# EAGLE design 328+ch340g_testas (EAGLE 6.5.0)
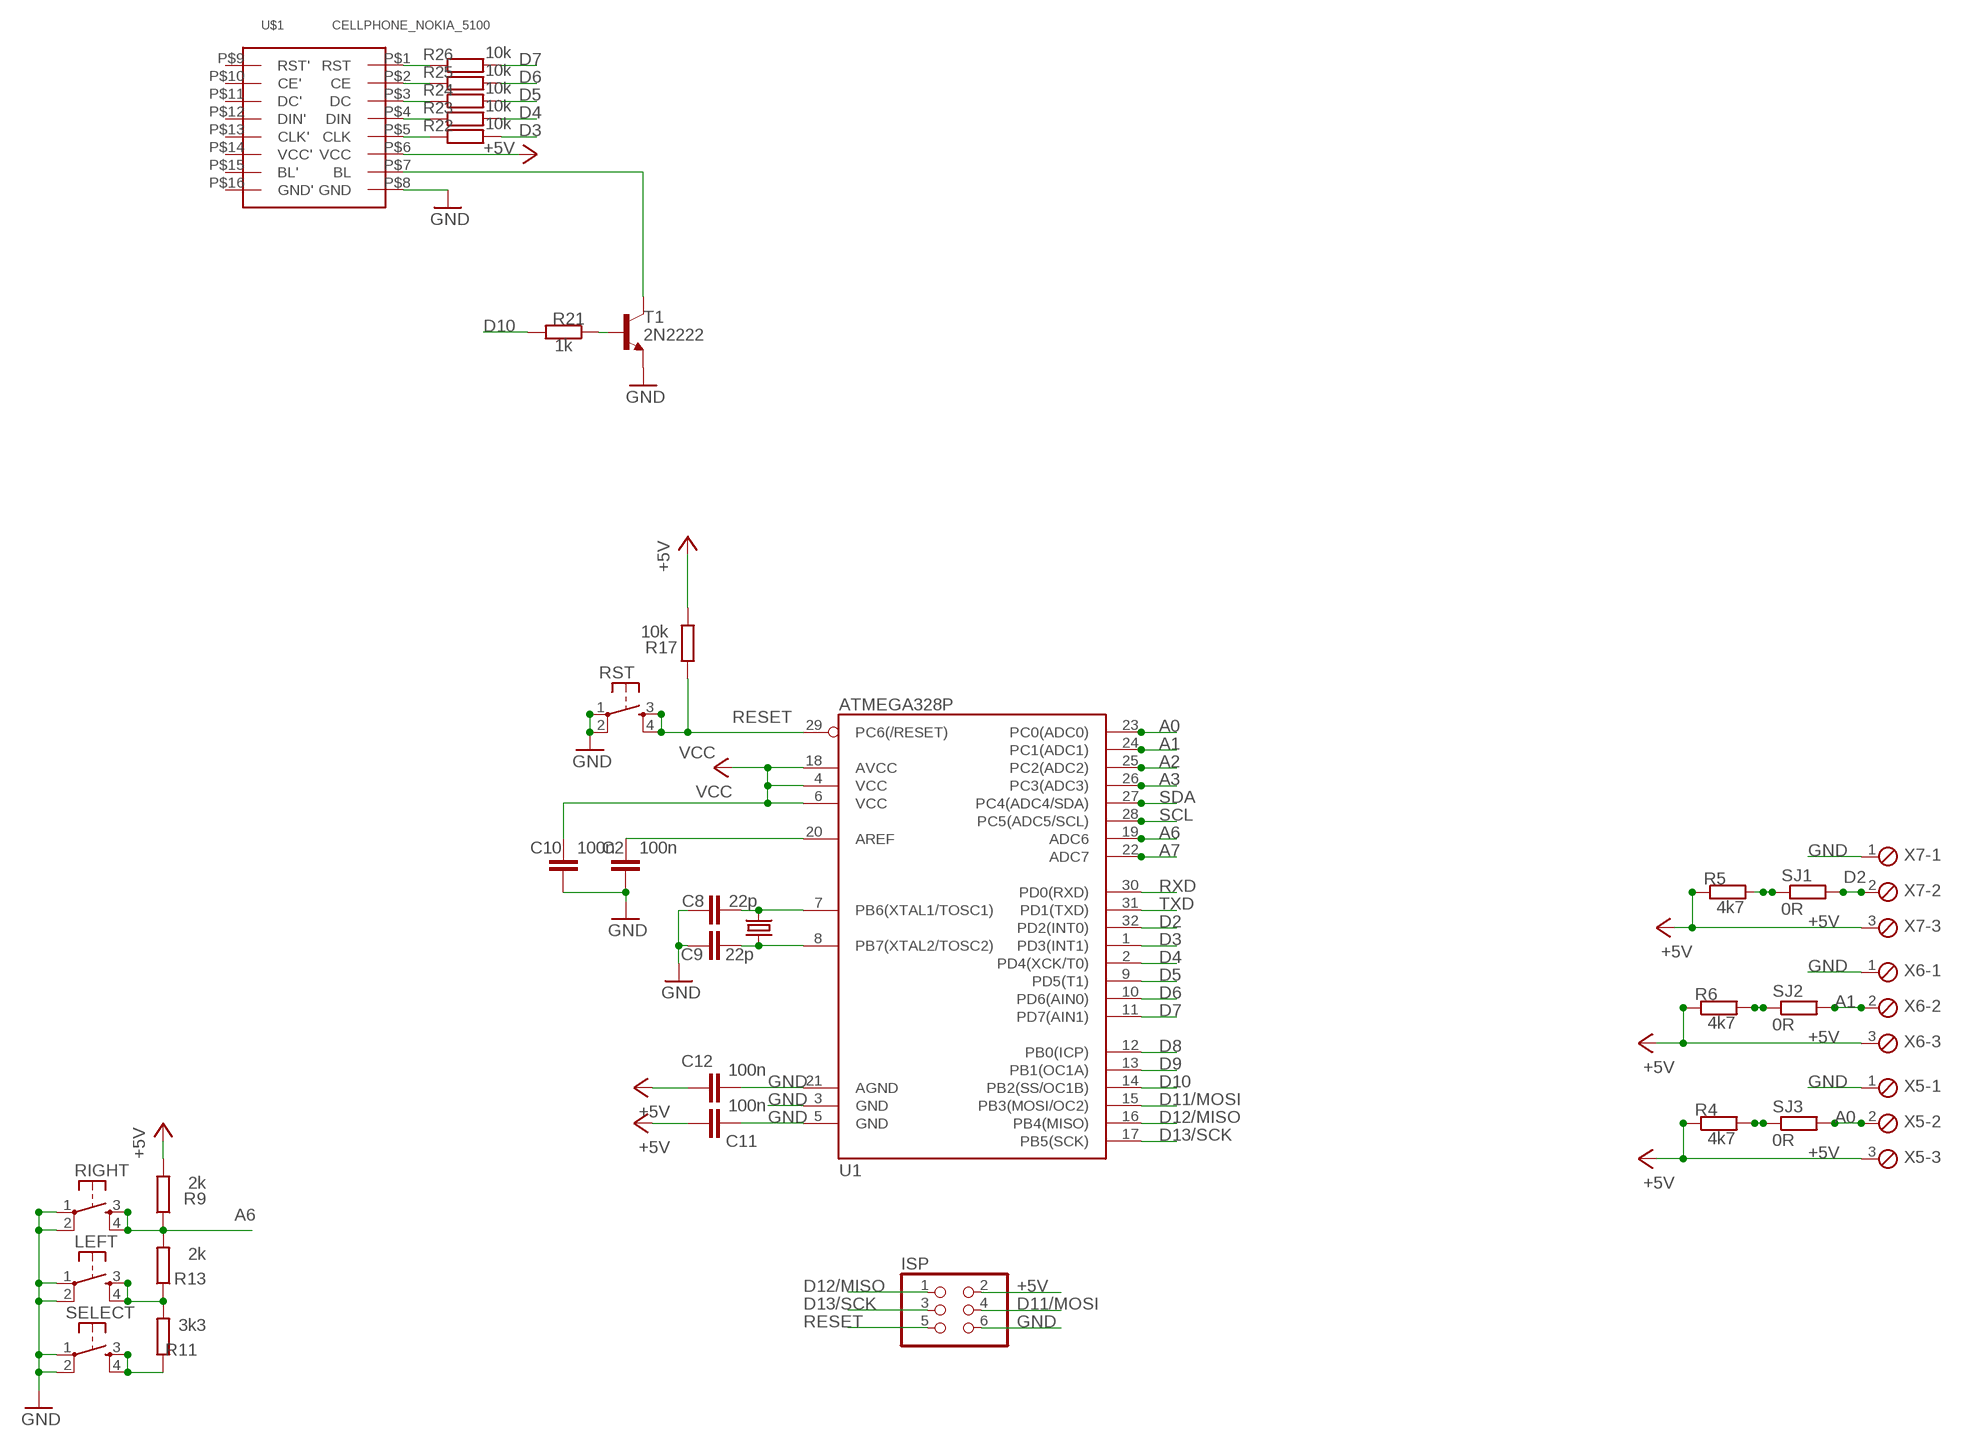
[diagram p0: schematic, sheet 1]

## Parts
C2  100n  C-EUC0805  [C0805]
C8  22p  C-EUC0805  [C0805]
C9  22p  C-EUC0805  [C0805]
C10  100n  C-EUC0805  [C0805]
C11  100n  C-EUC0805  [C0805]
C12  100n  C-EUC0805  [C0805]
ISP  PINHD-2X3  [2X03]
LEFT  TAC_SWITCHPTH  [TACTILE-PTH]
R4  4k7  R-EU_R0805  [R0805]
R5  4k7  R-EU_R0805  [R0805]
R6  4k7  R-EU_R0805  [R0805]
R9  2k  R-EU_R0805  [R0805]
R11  3k3  R-EU_R0805  [R0805]
R13  2k  R-EU_R0805  [R0805]
R17  10k  R-EU_R0805  [R0805]
R21  1k  R-EU_R0805  [R0805]
R22  10k  R-EU_R0805  [R0805]
R23  10k  R-EU_R0805  [R0805]
R24  10k  R-EU_R0805  [R0805]
R25  10k  R-EU_R0805  [R0805]
R26  10k  R-EU_R0805  [R0805]
RIGHT  TAC_SWITCHPTH  [TACTILE-PTH]
RST  TAC_SWITCHPTH  [TACTILE-PTH]
SELECT  TAC_SWITCHPTH  [TACTILE-PTH]
SJ1  0R  R-EU_R0402  [R0402]
SJ2  0R  R-EU_R0402  [R0402]
SJ3  0R  R-EU_R0402  [R0402]
T1  2N2222  [TO92-EBC-OVAL]
U1  ATMEGA328P  ATMEGA328_SMT  [TQFP32-08]
U$1  CELLPHONE_NOKIA_5100  [CELLPHONE_NOKIA_5100_SPARKFUN]
X2  16MHz  CRYSTALHC49US  [HC49US]
X5  MPT3  [3POL254]
X6  MPT3  [3POL254]
X7  MPT3  [3POL254]

## Nets
+5V: C11.2 C12.2 ISP.2 R4.1 R5.1 R6.1 R9.2 R17.2 U$1.P$6(VCC) X5.3 X6.3 X7.3
A0: SJ3.2 U1.23(PC0(ADC0)) X5.2
A1: SJ2.2 U1.24(PC1(ADC1)) X6.2
A2: U1.25(PC2(ADC2))
A3: U1.26(PC3(ADC3))
A6: R9.1 R13.2 RIGHT.3 RIGHT.4 U1.19(ADC6)
A7: U1.22(ADC7)
D2: SJ1.2 U1.32(PD2(INT0)) X7.2
D3: R22.2 U1.1(PD3(INT1))
D4: R23.2 U1.2(PD4(XCK/T0))
D5: R24.2 U1.9(PD5(T1))
D6: R25.2 U1.10(PD6(AIN0))
D7: R26.2 U1.11(PD7(AIN1))
D8: U1.12(PB0(ICP))
D9: U1.13(PB1(OC1A))
D10: R21.2 U1.14(PB2(SS/OC1B))
D11/MOSI: ISP.4 U1.15(PB3(MOSI/OC2))
D12/MISO: ISP.1 U1.16(PB4(MISO))
D13/SCK: ISP.3 U1.17(PB5(SCK))
GND: C2.2 C8.1 C9.1 C10.2 C11.1 C12.1 ISP.6 LEFT.1 LEFT.2 RIGHT.1 RIGHT.2 RST.1 RST.2 SELECT.1 SELECT.2 T1.E U1.3(GND) U1.5(GND) U1.21(AGND) U$1.P$8(GND) X5.1 X6.1 X7.1
N$1: LEFT.3 LEFT.4 R11.2 R13.1
N$17: R6.2 SJ2.1
N$18: R11.1 SELECT.3 SELECT.4
N$22: R22.1 U$1.P$5(CLK)
N$23: R25.1 U$1.P$2(CE)
N$24: R24.1 U$1.P$3(DC)
N$25: R23.1 U$1.P$4(DIN)
N$26 [signal]: T1.C U$1.P$7(BL)
N$28: R4.2 SJ3.1
N$31: R5.2 SJ1.1
N$32: C9.2 U1.8(PB7(XTAL2/TOSC2)) X2.1
N$33: C8.2 U1.7(PB6(XTAL1/TOSC1)) X2.2
N$35: C2.1 U1.20(AREF)
N$44: R21.1 T1.B
RESET: ISP.5 R17.1 RST.3 RST.4 U1.29(PC6(/RESET))
RXD: U1.30(PD0(RXD))
SCL: U1.28(PC5(ADC5/SCL))
SDA: U1.27(PC4(ADC4/SDA))
TXD: U1.31(PD1(TXD))
V$: R26.1 U$1.P$1(RST)
VCC: C10.1 U1.4(VCC) U1.6(VCC) U1.18(AVCC)
Unconnected: U$1.P$9(RST') U$1.P$10(CE') U$1.P$11(DC') U$1.P$12(DIN') U$1.P$13(CLK') U$1.P$14(VCC') U$1.P$15(BL') U$1.P$16(GND')

## Library data of the parts
C2 C8-C12 = resistor:C-EU: CAPACITOR, European symbol
ISP = pinhead:PINHD-2X3: PIN HEADER
LEFT RIGHT RST SELECT = SparkFun-Electromechanical:TAC_SWITCH: Momentary Switch Button commonly used for reset or general input. Spark Fun Electronics SKU : COM-00097 SMT- SWCH-08247
R4-R6 R9 R11 R13 R17 R21-R26 SJ1-SJ3 = rcl:R-EU_: RESISTOR, European symbol
T1 = adafruit:2N2222: NPN TRANSISTOR Big oval pads
U1 = SparkFun-DigitalIC:ATMEGA328_SMT: 32-Pin Atmega328 part Commonly used on Arduino compatible boards Available in QFP and QFN packages TQFP is IC-09069 QFN is non-stock; PROD_ID: IC-09069
U$1 = DIY-Cellphone:CELLPHONE_NOKIA_5100
X2 = SparkFun:CRYSTAL: Crystals Various standard crystals. Proven footprints. Spark Fun Electronics SKU : COM-00534
X5-X7 = con-phoenix-254:MPT3: PHOENIX CONNECTOR; OC_FARNELL: unknown; OC_NEWARK: unknown

## Net classes
0 default: width 0.406 mm, clearance 0.203 mm
1 power: width 0.61 mm, clearance 0.203 mm
2 GND: width 0.61 mm
3 signal: width 0.457 mm

## Board
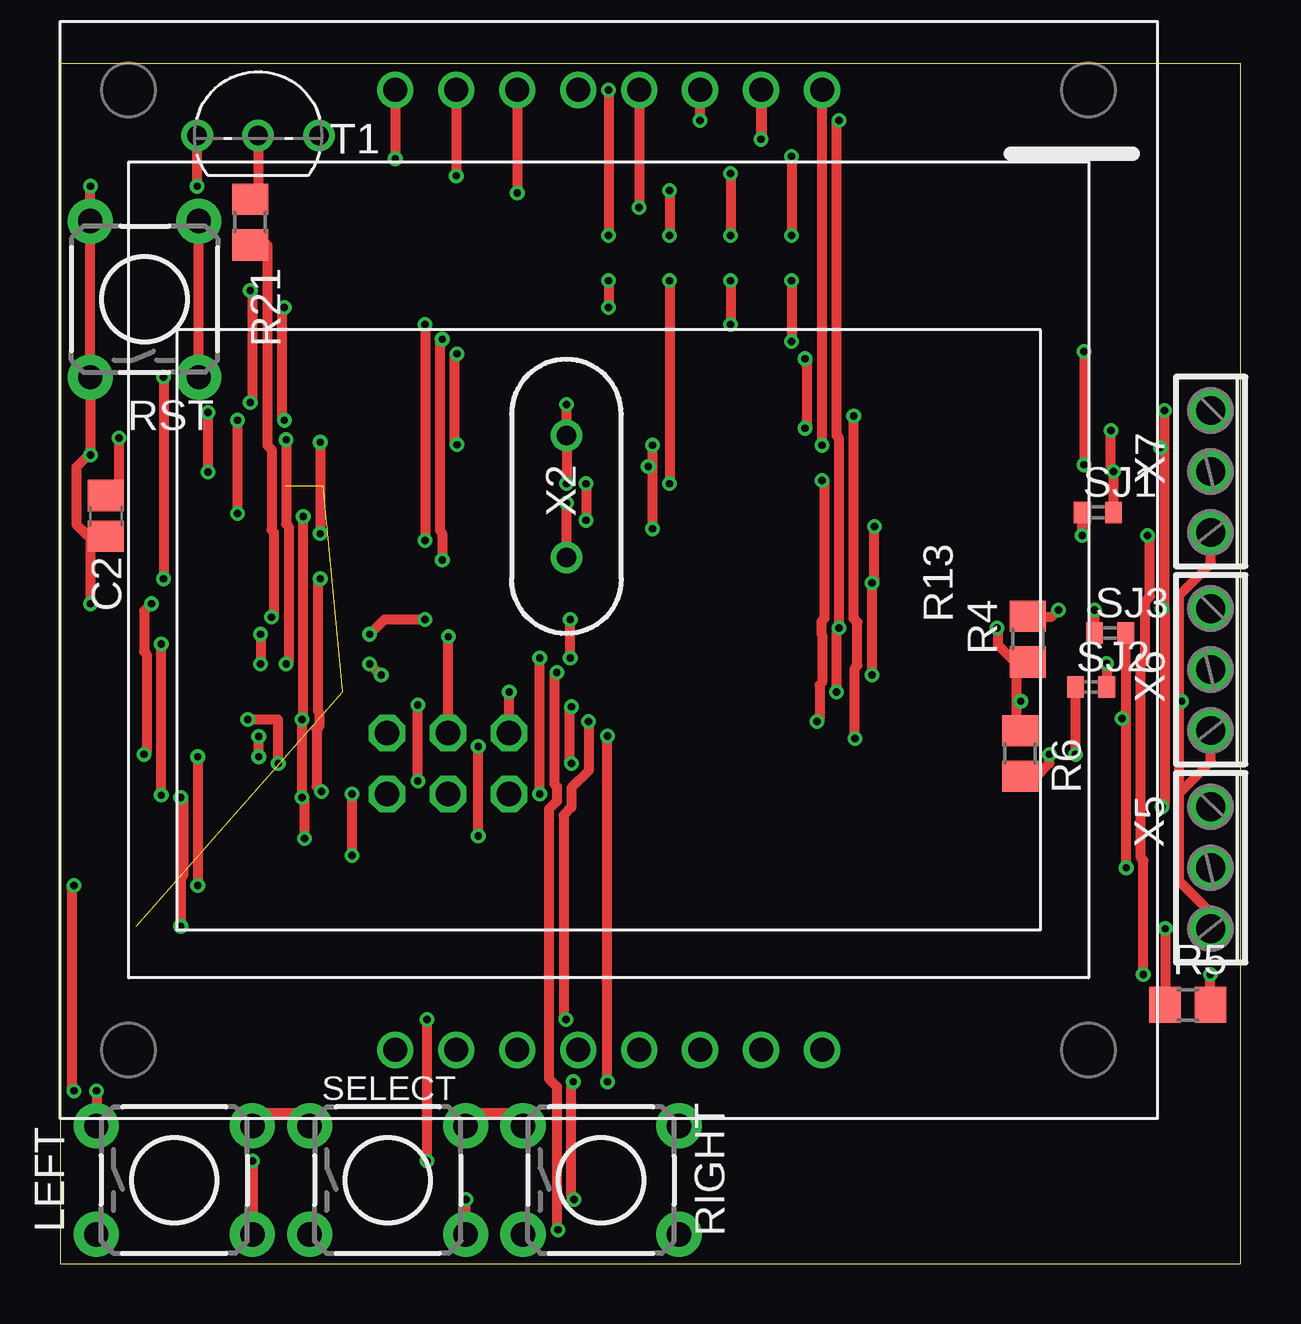
[diagram p1: board, top side]
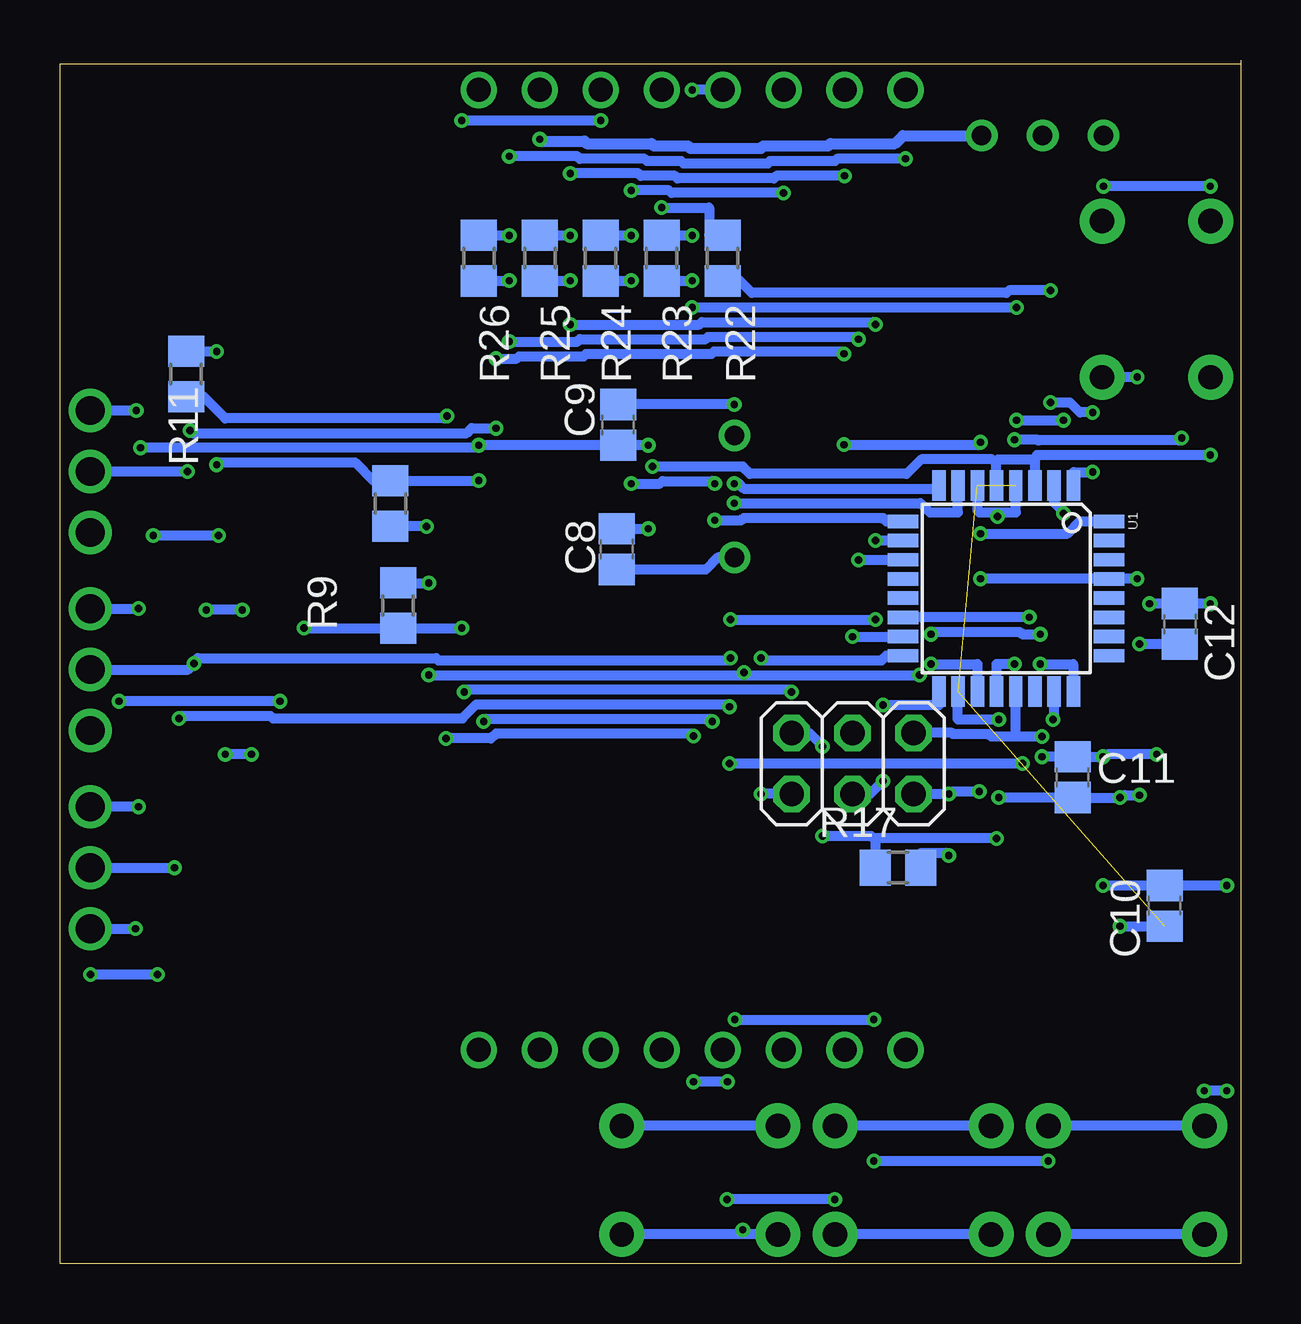
[diagram p2: board, bottom side, seen from below]

Size 49.2 x 50.16 mm. Coordinates in mm from the lower left corner, seen from the top.
Outline: 0,50 49.2,50 49.2,0 0,0 0,50.16
Copper layers (1*16): Top 0.035mm / dielectric 1.5mm / Bottom 0.035mm
Design rules "ITEADstudio_DRC": minimum track width 6mil, minimum drill 12mil, track to track 6mil, track to pad 6mil, pad to pad 6mil, via to via 6mil, smd to smd 0mil, copper to edge 10mil, drill to drill 10mil, minimum pad ring 10mil, minimum via ring 6mil, stop-mask expansion 2mil, vias tented up to drill 100mil, thermal gap 10mil
Holes 2 mm at 97.79,46.99
vRestrict: area 32,73 to 71,78

### Footprints (pad centres in the part's own frame; a part is rotated, then mirrored left to right if it is on the bottom)
C0805 = smd 1.3 x 1.5: 1 -0.85,0; 2 0.85,0
2X03 = drill 1.016 octagon: 1 -2.54,-1.27; 2 -2.54,1.27; 3 0,-1.27; 4 0,1.27; 5 2.54,-1.27; 6 2.54,1.27
TACTILE-PTH = drill 1.016 pad 1.88: 1 -3.251,2.261; 2 3.251,2.261; 3 -3.251,-2.261; 4 3.251,-2.261
R0805 = smd 1.3 x 1.5: 1 -0.95,0; 2 0.95,0
R0402 = smd 0.7 x 0.9: 1 -0.65,0; 2 0.65,0
TO92-EBC-OVAL = drill 0.813: B 0,-1.27; C 2.54,-1.27; E -2.54,-1.27
TQFP32-08 = smd 1.27 x 0.559: 1 -4.293,2.8; 2 -4.293,2; 3 -4.293,1.2; 4 -4.293,0.4; 5 -4.293,-0.4; 6 -4.293,-1.2; 7 -4.293,-2; 8 -4.293,-2.8; 17 4.293,-2.8; 18 4.293,-2; 19 4.293,-1.2; 20 4.293,-0.4; 21 4.293,0.4; 22 4.293,1.2; 23 4.293,2; 24 4.293,2.8 | smd 0.559 x 1.27: 9 -2.8,-4.293; 10 -2,-4.293; 11 -1.2,-4.293; 12 -0.4,-4.293; 13 0.4,-4.293; 14 1.2,-4.293; 15 2,-4.293; 16 2.8,-4.293; 25 2.8,4.293; 26 2,4.293; 27 1.2,4.293; 28 0.4,4.293; 29 -0.4,4.293; 30 -1.2,4.293; 31 -2,4.293; 32 -2.8,4.293
CELLPHONE_NOKIA_5100_SPARKFUN = drill 1: P$1 -8.89,20; P$2 -6.35,20; P$3 -3.81,20; P$4 -1.27,20; P$5 1.27,20; P$6 3.81,20; P$7 6.35,20; P$8 8.89,20; P$9 -8.89,-20; P$10 -6.35,-20; P$11 -3.81,-20; P$12 -1.27,-20; P$13 1.27,-20; P$14 3.81,-20; P$15 6.35,-20; P$16 8.89,-20
HC49US = drill 0.813: 1 -2.54,0; 2 2.54,0
3POL254 = drill 1.2: 1 -2.54,0; 2 0,0; 3 2.54,0

### Placement (x,y rotation side)
C2  1.91,31.17 270 top
C8  26,29.79 270 bottom
C9  25.95,34.96 90 bottom
C10  3.17,14.92 90 bottom
C11  7.01,20.28 270 bottom
C12  2.54,26.67 270 bottom
ISP  16.17,20.85 0 bottom
LEFT  4.76,3.49 0 top
R4  40.32,26.04 90 top
R5  46.99,10.79 0 top
R6  40.01,21.27 270 top
R9  35.12,27.43 270 bottom
R11  43.94,37.08 90 bottom
R13  35.43,31.69 270 bottom
R17  14.29,16.51 180 bottom
R21  7.92,43.41 270 top
R22  21.59,41.91 270 bottom
R23  24.13,41.91 270 bottom
R24  26.67,41.91 270 bottom
R25  29.21,41.91 270 bottom
R26  31.75,41.91 270 bottom
RIGHT  22.54,3.49 0 top
RST  3.52,40.2 90 top
SELECT  13.65,3.49 0 top
SJ1  43.24,31.32 0 top
SJ2  42.96,24.04 0 top
SJ3  43.75,26.29 0 top
T1  8.26,48.29 0 top
U1  9.78,28.14 270 bottom
U$1  22.86,28.92 0 top
X2  21.1,31.98 270 top
X5  47.94,16.51 270 top
X6  47.94,24.77 270 top
X7  47.94,33.02 270 top

### Tracks (layer width: path | path; a pad name or v marks a point on that pad's centre or on a via)
+5V  (via drill 0.3)
  Top 0.406: v5.03,14.07 5.03,16.08 5.13,16.18 5.13,19.33 v5.03,19.43 | v10.19,17.73 10.19,19.25 v10.08,19.43 v10.08,22.68 10.13,22.86 v10.13,31.14 | v4.22,19.53 v4.22,25.83 | v17.42,17.83 v17.42,21.57 | 46.77,19.75 46.63,19.61 46.63,15.95 47.95,14.63 47.95,13.97 X5.3 | 46.77,19.75 47.95,20.93 47.95,22.23 X6.3 | 46.63,23.44 46.63,19.89 46.77,19.75 | 46.63,23.44 46.63,27.86 47.95,29.18 47.95,30.48 X7.3 | v46.05,13.97 R5.1 | 39.85,23.44 39.85,25.09 R4.1 39.67,25.2 39.09,25.78 39.09,26.44 v39.04,26.49 | 39.85,23.44 39.85,22.23 R6.1 | v46.74,23.44 46.63,23.44 | v40.03,23.44 39.85,23.44 | v26.67,47.65 U$1.P$6 | v32.46,47.65 32.36,47.55 32.36,34.52 32.46,34.42 v32.46,26.49 32.36,26.31 v32.36,23.82 | v18.72,23.82 ISP.2
  Bottom 0.406: 9.37,32.41 9.37,31.32 10.13,31.32 | 10.13,31.32 10.9,31.32 10.97,31.39 10.97,32.41 | 11.79,23.82 11.79,22.68 v10.08,22.68 | v10.08,19.43 C11.2 6.83,19.43 v5.03,19.43 4.85,19.53 v4.22,19.53 | v5.03,14.07 3.17,14.07 | 15.24,17.73 R17.2 | v10.19,17.73 15.24,17.73 | v4.22,25.83 2.54,25.83 C12.2 | v10.13,31.14 10.13,31.32 | v17.42,21.57 17.98,22.12 18.69,22.12 ISP.2 | v17.42,17.83 15.42,17.83 15.24,17.73 | X5.3 v46.05,13.97 | v39.04,26.49 35.13,26.49 R9.2 34.92,26.49 v32.46,26.49 | v40.03,23.44 v46.74,23.44 | v32.46,47.65 v26.67,47.65 | v32.36,23.82 32.26,23.93 18.82,23.93 v18.72,23.82
A0  (via drill 0.3)
  Top 0.406: v44.42,16.51 44.42,22.73 | 44.42,22.73 44.42,24.94 44.4,24.97 SJ3.2 | v7.82,22.68 9.09,22.68 v9.09,20.85 | v21.31,20.85 21.21,20.95 21.21,23.11 v21.31,23.22 | v44.25,22.73 44.42,22.73
  Bottom 0.406: X5.2 v44.42,16.51 | v7.82,22.68 7.77,22.68 7.77,23.82 U1.23 | v21.31,20.85 v9.09,20.85 | v21.31,23.22 21.41,23.32 31.85,23.32 32.44,22.73 40.34,22.73 40.44,22.84 44.15,22.84 v44.25,22.73
A1  (via drill 0.3)
  Top 0.406: v43.61,25.02 43.61,24.05 SJ2.2 | v8.36,26.24 v8.36,24.99 | v12.9,26.24 13.51,26.85 v15.21,26.85 | v21.26,25.25 v21.26,26.85
  Bottom 0.406: X6.2 43.87,24.77 v43.61,25.02 43.51,25.2 43.46,25.25 33.53,25.25 33.43,25.15 21.36,25.15 v21.26,25.25 | v8.36,24.99 6.99,24.99 U1.24 | v8.36,26.24 9.12,26.24 9.22,26.34 12.8,26.34 v12.9,26.24 | v21.26,26.85 v15.21,26.85
A6  (via drill 0.3)
  Top 0.406: v12.9,24.99 13.36,24.54 v13.39,24.54 | v33.83,24.54 v33.83,28.37 33.93,28.55 v33.93,30.73 | v20.75,1.42 20.7,1.47 20.7,7.39 20.37,7.72 20.37,18.95 20.7,19.28 20.7,19.89 20.6,19.99 20.6,24.54 v20.7,24.64
  Bottom 0.406: 20.75,1.25 19.3,1.25 RIGHT.3 | 20.75,1.25 25.78,1.25 RIGHT.4 | v12.9,24.99 10.97,24.99 U1.19 | v33.83,24.54 20.7,24.54 | 20.7,24.54 v13.39,24.54 | v33.83,28.37 35.1,28.37 R9.1 | v33.93,30.73 R13.2 | v20.75,1.42 20.75,1.25 | v20.7,24.64 20.7,24.54
D2  (via drill 0.3)
  Top 0.406: SJ1.2 v43.89,33.02 43.79,33.2 v43.79,34.72 | v10.85,34.24 v10.85,30.43 | v16.54,34.14 16.43,34.24 16.43,37.82 v16.54,37.92 | v31.04,37.72 31.14,37.62 31.14,34.92 v31.04,34.82
  Bottom 0.406: X7.2 v43.89,33.02 | v10.85,30.43 7.21,30.43 6.71,30.94 U1.32 | v10.85,34.24 10.95,34.14 v16.54,34.14 | v16.54,37.92 16.64,38.02 21.95,38.02 22.05,37.92 27.28,37.92 27.38,37.82 30.07,37.82 30.18,37.72 v31.04,37.72 | v31.04,34.82 32.05,34.82 32.26,34.62 43.69,34.62 v43.79,34.72
D3  (via drill 0.3)
  Top 0.406: v7.92,40.56 8.03,40.46 8.03,35.99 v7.92,35.89 | v6.17,32.99 v6.17,35.48
  Bottom 0.406: v7.92,40.56 9.65,40.56 9.75,40.46 20.37,40.46 20.88,40.97 R22.2 | v7.92,35.89 7.14,35.89 7.11,35.87 7.09,35.87 6.71,35.48 v6.17,35.48 | v6.17,32.99 6.96,32.99 6.99,32.97 U1.1
D4  (via drill 0.3)
  Top 0.406: v7.39,35.15 v7.39,31.27 | v9.35,35.15 9.25,35.26 9.25,39.75 v9.35,39.85 | v22.86,40.97 v22.86,39.85
  Bottom 0.406: v7.39,31.27 7.39,31.34 7.77,31.73 7.77,32.41 U1.2 | v9.35,35.15 v7.39,35.15 | v22.86,39.85 v9.35,39.85 | v22.86,40.97 R23.2
D5  (via drill 0.3)
  Top 0.406: v21.92,32.51 v21.92,30.99 | v25.4,40.97 v25.4,32.51
  Bottom 0.406: v21.92,30.99 20.8,30.99 20.7,31.09 14.91,31.09 14.76,30.94 U1.9 | v21.92,32.51 22.02,32.61 24.11,32.61 24.21,32.51 v25.4,32.51 | v25.4,40.97 R24.2
D6  (via drill 0.3)
  Top 0.406: v15.21,39.14 v15.21,30.15 | v27.94,40.97 v27.94,39.14
  Bottom 0.406: v15.21,30.15 U1.10 | v15.21,39.14 15.32,39.24 22.45,39.24 22.55,39.14 v27.94,39.14 | v27.94,40.97 R25.2
D7  (via drill 0.3)
  Top 0.406: v15.93,29.34 15.93,30.45 15.82,30.56 15.82,38.43 v15.93,38.53 | v30.48,40.97 v30.48,38.43
  Bottom 0.406: v15.93,29.34 U1.11 | v15.93,38.53 16.03,38.63 22.2,38.63 22.3,38.53 27.53,38.53 27.64,38.43 v30.48,38.43 | v30.48,40.97 R26.2
D10  (via drill 0.3)
  Top 0.406: v8.81,26.95 8.91,27.05 8.91,30.48 8.81,30.58 8.81,33.93 8.64,34.11 8.64,42.44 8.61,42.47 R21.2
  Bottom 0.406: v8.81,26.95 14.05,26.95 U1.14
D11/MOSI  (via drill 0.3)
  Top 0.406: v16.18,26.14 ISP.4
  Bottom 0.406: v16.18,26.14 U1.15
D12/MISO  (via drill 0.3)
  Top 0.406: v19.99,19.58 v19.99,25.25
  Bottom 0.406: v19.99,25.25 19.89,25.15 14.96,25.15 14.76,25.35 U1.16 | v19.99,19.58 ISP.1
D13/SCK  (via drill 0.3)
  Top 0.406: v14.91,20.12 v14.91,23.29
  Bottom 0.406: v14.91,23.29 12.57,23.29 12.57,23.82 U1.17 | v14.91,20.12 15.44,19.58 16.15,19.58 ISP.3
GND  (via drill 0.3)
  Top 0.406: v8.28,21.13 v8.28,21.97 | v24.69,30.63 24.69,33.22 | 24.69,33.22 v24.69,34.11 | 1.27,30.3 v1.27,27.51 | 1.27,30.3 1.29,30.33 C2.2 | v5.71,44.91 T1.E | v1.27,44.91 1.27,43.64 RST.2 1.27,43.43 RST.1 1.27,36.75 v1.27,33.71 1.09,33.6 0.69,33.2 0.69,30.81 1.09,30.4 1.27,30.3 | v24.51,33.22 24.69,33.22 | SELECT.1 10.41,5.77 10.41,6.27 10.39,6.3 8.03,6.3 8.03,5.77 LEFT.2 | RIGHT.1 19.3,5.77 19.3,6.27 19.28,6.3 16.92,6.3 16.92,5.77 SELECT.2 | v45.92,19.05 46.02,19.15 46.02,27.2 v45.92,27.3 46.02,27.48 46.02,34.01 | 46.02,34.01 v46.02,35.56 | v5.74,21.13 v5.74,15.77 | v31.75,34.11 U$1.P$8 | v3.5,21.23 3.61,21.34 3.61,25.43 3.5,25.53 3.5,27.2 v3.81,27.51 | v45.85,34.01 46.02,34.01 | v1.52,7.21 1.52,5.77 LEFT.1 | v0.58,7.21 0.48,7.32 0.48,15.67 v0.58,15.77
  Bottom 0.406: v8.28,21.97 9.37,21.97 | 9.37,21.97 10.39,21.97 10.49,22.07 11.99,22.07 12.04,22.12 13.61,22.12 ISP.6 | v8.28,21.13 C11.1 6.83,21.13 v5.74,21.13 5.56,21.23 v3.5,21.23 | 9.37,21.97 9.37,23.82 U1.21 | v24.69,34.11 25.93,34.11 C9.1 26.14,34.11 v31.75,34.11 31.93,34.01 v45.85,34.01 | v24.69,30.63 25.98,30.63 C8.1 | v1.27,27.51 2.54,27.51 C12.1 2.72,27.51 v3.81,27.51 | 8.59,33.53 U1.3 | 8.59,33.53 10.11,33.53 10.19,33.45 | 10.19,33.45 U1.5 | v1.27,33.71 8.48,33.71 8.59,33.53 | v1.27,44.91 v5.71,44.91 | v24.51,33.22 20.75,33.22 20.45,32.92 13.92,32.92 13.31,33.53 10.36,33.53 10.19,33.45 | LEFT.2 8,5.77 1.52,5.77 LEFT.1 | SELECT.2 16.89,5.77 10.41,5.77 SELECT.1 | RIGHT.2 25.78,5.77 19.3,5.77 RIGHT.1 | v45.92,19.05 X5.1 | X6.1 v45.92,27.3 | v46.02,35.56 X7.1 | v5.74,15.77 C10.2 | C10.2 | v0.58,7.21 v1.52,7.21 | v0.58,15.77 3,15.77 C10.2
N$1  (via drill 0.3)
  Top 0.406: v42.67,38.02 v42.67,33.3 | v8.03,4.29 8.03,1.25 LEFT.4 | v15.29,10.19 v15.29,4.29 | v21.08,10.19 20.98,10.29 20.98,18.69 21.31,19.02 21.31,19.84 22.02,20.55 v22.02,22.61 | v31.55,22.61 31.65,22.71 31.65,24.13 31.75,24.23 31.75,26.21 31.73,26.24 31.73,26.77 31.85,26.9 31.85,32.54 v31.75,32.64
  Bottom 0.406: LEFT.4 8,1.25 1.52,1.25 LEFT.3 | v42.67,33.3 42.57,33.4 36.91,33.4 36.14,32.64 R13.1 35.26,32.64 v31.75,32.64 | v42.67,38.02 R11.2 | v15.29,4.29 v8.03,4.29 | v21.08,10.19 v15.29,10.19 | v22.02,22.61 22.12,22.71 31.45,22.71 v31.55,22.61
N$17  (via drill 0.3)
  Top 0.406: v42.32,21.23 42.32,24.03 SJ2.1 | v41.22,21.23 41.22,20.85 40.69,20.32 R6.2
  Bottom 0.406: v41.22,21.23 v42.32,21.23
N$18  (via drill 0.3)
  Top 0.406: v33.07,35.33 33.07,26.9 33.22,26.75 33.22,24.94 33.12,24.84 v33.12,21.89 | v22.81,7.59 v22.81,22 | v21.39,7.59 21.34,7.54 21.34,7.42 21.31,7.39 21.31,2.79 v21.41,2.69 | v16.92,2.69 16.92,1.25 SELECT.4
  Bottom 0.406: SELECT.4 16.89,1.25 10.41,1.25 SELECT.3 | v33.07,35.33 33.17,35.23 42.32,35.23 43.23,36.14 43.94,36.14 R11.1 | v33.12,21.89 31.24,21.89 31.04,22.1 22.91,22.1 v22.81,22 | v21.39,7.59 v22.81,7.59 | v16.92,2.69 v21.41,2.69
N$22  (via drill 0.3)
  Top 0.406: U$1.P$5 v24.13,44.02
  Bottom 0.406: v24.13,44.02 22.15,44.02 22.15,42.88 22.12,42.85 R22.1
N$23  (via drill 0.3)
  Top 0.406: v27.94,45.44 v27.94,42.85 | U$1.P$2 v16.51,45.34
  Bottom 0.406: v27.94,42.85 R25.1 | v27.94,45.44 25.09,45.44 24.99,45.34 23.57,45.34 23.47,45.24 19.46,45.24 19.36,45.34 v16.51,45.34
N$24  (via drill 0.3)
  Top 0.406: v25.4,44.73 v25.4,42.85 | U$1.P$3 v19.05,44.63
  Bottom 0.406: v25.4,42.85 R24.1 | v25.4,44.73 23.82,44.73 23.72,44.63 v19.05,44.63
N$25  (via drill 0.3)
  Top 0.406: v22.86,48.92 v22.86,42.85
  Bottom 0.406: v22.86,42.85 R23.1 | v22.86,48.92 U$1.P$4
N$26  (via drill 0.3)
  Top 0.457: U$1.P$7 v29.21,46.86
  Bottom 0.457: T1.C 14.07,47.02 14.4,46.69 17.09,46.69 17.2,46.58 19.89,46.58 19.99,46.48 22.94,46.48 23.04,46.58 24.46,46.58 24.56,46.69 27.25,46.69 27.36,46.79 29.13,46.79 v29.21,46.86
N$28  (via drill 0.3)
  Top 0.406: v43.1,27.25 SJ3.1 | v41.6,27.25 41.33,26.98 40.34,26.98 R4.2
  Bottom 0.406: v41.6,27.25 v43.1,27.25
N$31  (via drill 0.3)
  Top 0.406: v42.6,30.35 SJ1.1 | v45.31,30.35 45.41,30.25 45.41,27.81 45.21,27.61 45.21,25.12 45.03,24.94 45.03,16.92 45.14,16.82 v45.14,12.06 | v47.93,12.06 R5.2
  Bottom 0.406: v45.31,30.35 v42.6,30.35 | v47.93,12.06 v45.14,12.06
N$32  (via drill 0.3)
  Top 0.406: v21.11,32.51 X2.1 21.11,34.72 v21.11,35.81
  Bottom 0.406: v21.11,32.51 20.9,32.51 20.7,32.31 12.57,32.31 12.57,32.41 U1.8 | v21.11,35.81 25.93,35.81 C9.2
N$33  (via drill 0.3)
  Top 0.406: v21.11,31.7 21.11,29.46 X2.2
  Bottom 0.406: v21.11,31.7 13.36,31.7 13.31,31.65 13.28,31.65 12.95,31.32 11.79,31.32 11.79,32.41 U1.7 | C8.2 25.98,28.93 22.3,28.93 21.79,29.44 X2.2
N$35  (via drill 0.3)
  Top 0.406: v9.42,24.99 9.53,25.09 9.53,30.73 9.42,30.84 v9.42,34.34 | v2.46,34.42 2.46,32.05 2.44,32.03 1.93,32.03 C2.1
  Bottom 0.406: v9.42,24.99 10.19,24.99 U1.20 | v9.42,34.34 8.46,34.34 8.43,34.31 2.56,34.31 v2.46,34.42
N$44
  Top 0.406: T1.B 8.26,44.35 7.92,44.35 R21.1
RESET  (via drill 0.3)
  Top 0.406: v12.17,19.58 v12.17,17.02 | RST.4 5.79,43.43 5.79,36.96 RST.3 | v4.32,36.96 v4.32,28.55 | v10.9,19.68 10.69,19.89 10.69,22.28 10.79,22.38 10.79,22.99 10.74,23.04 10.74,28.45 v10.85,28.55
  Bottom 0.406: v12.17,17.02 12.27,17.12 13.34,17.12 R17.1 | ISP.5 13.61,19.58 v12.17,19.58 11.99,19.68 v10.9,19.68 | v4.32,28.55 5.46,28.55 U1.29 5.69,28.55 v10.85,28.55 | v4.32,36.96 5.77,36.96 RST.3
V$  (via drill 0.3)
  Top 0.406: v30.48,46.15 v30.48,42.85 | U$1.P$1 v13.97,46.05
  Bottom 0.406: v30.48,42.85 R26.1 | v30.48,46.15 27.64,46.15 27.53,46.05 24.84,46.05 24.74,45.95 23.32,45.95 23.22,45.85 19.71,45.85 19.61,45.95 16.92,45.95 16.82,46.05 v13.97,46.05
VCC  (3 unrouted)

### Text on the board
tNames: Saules kolektoriaus valdiklis v2.0 | www.SauleVire.lt | 2014.02
BoxDim: Serpac WM-032C Enclosure | All units are in inch | Left | Right | Front | Bottom